# EAGLE design LOCO-Servo (EAGLE 9.7.0)

## Sheet 1 of 2
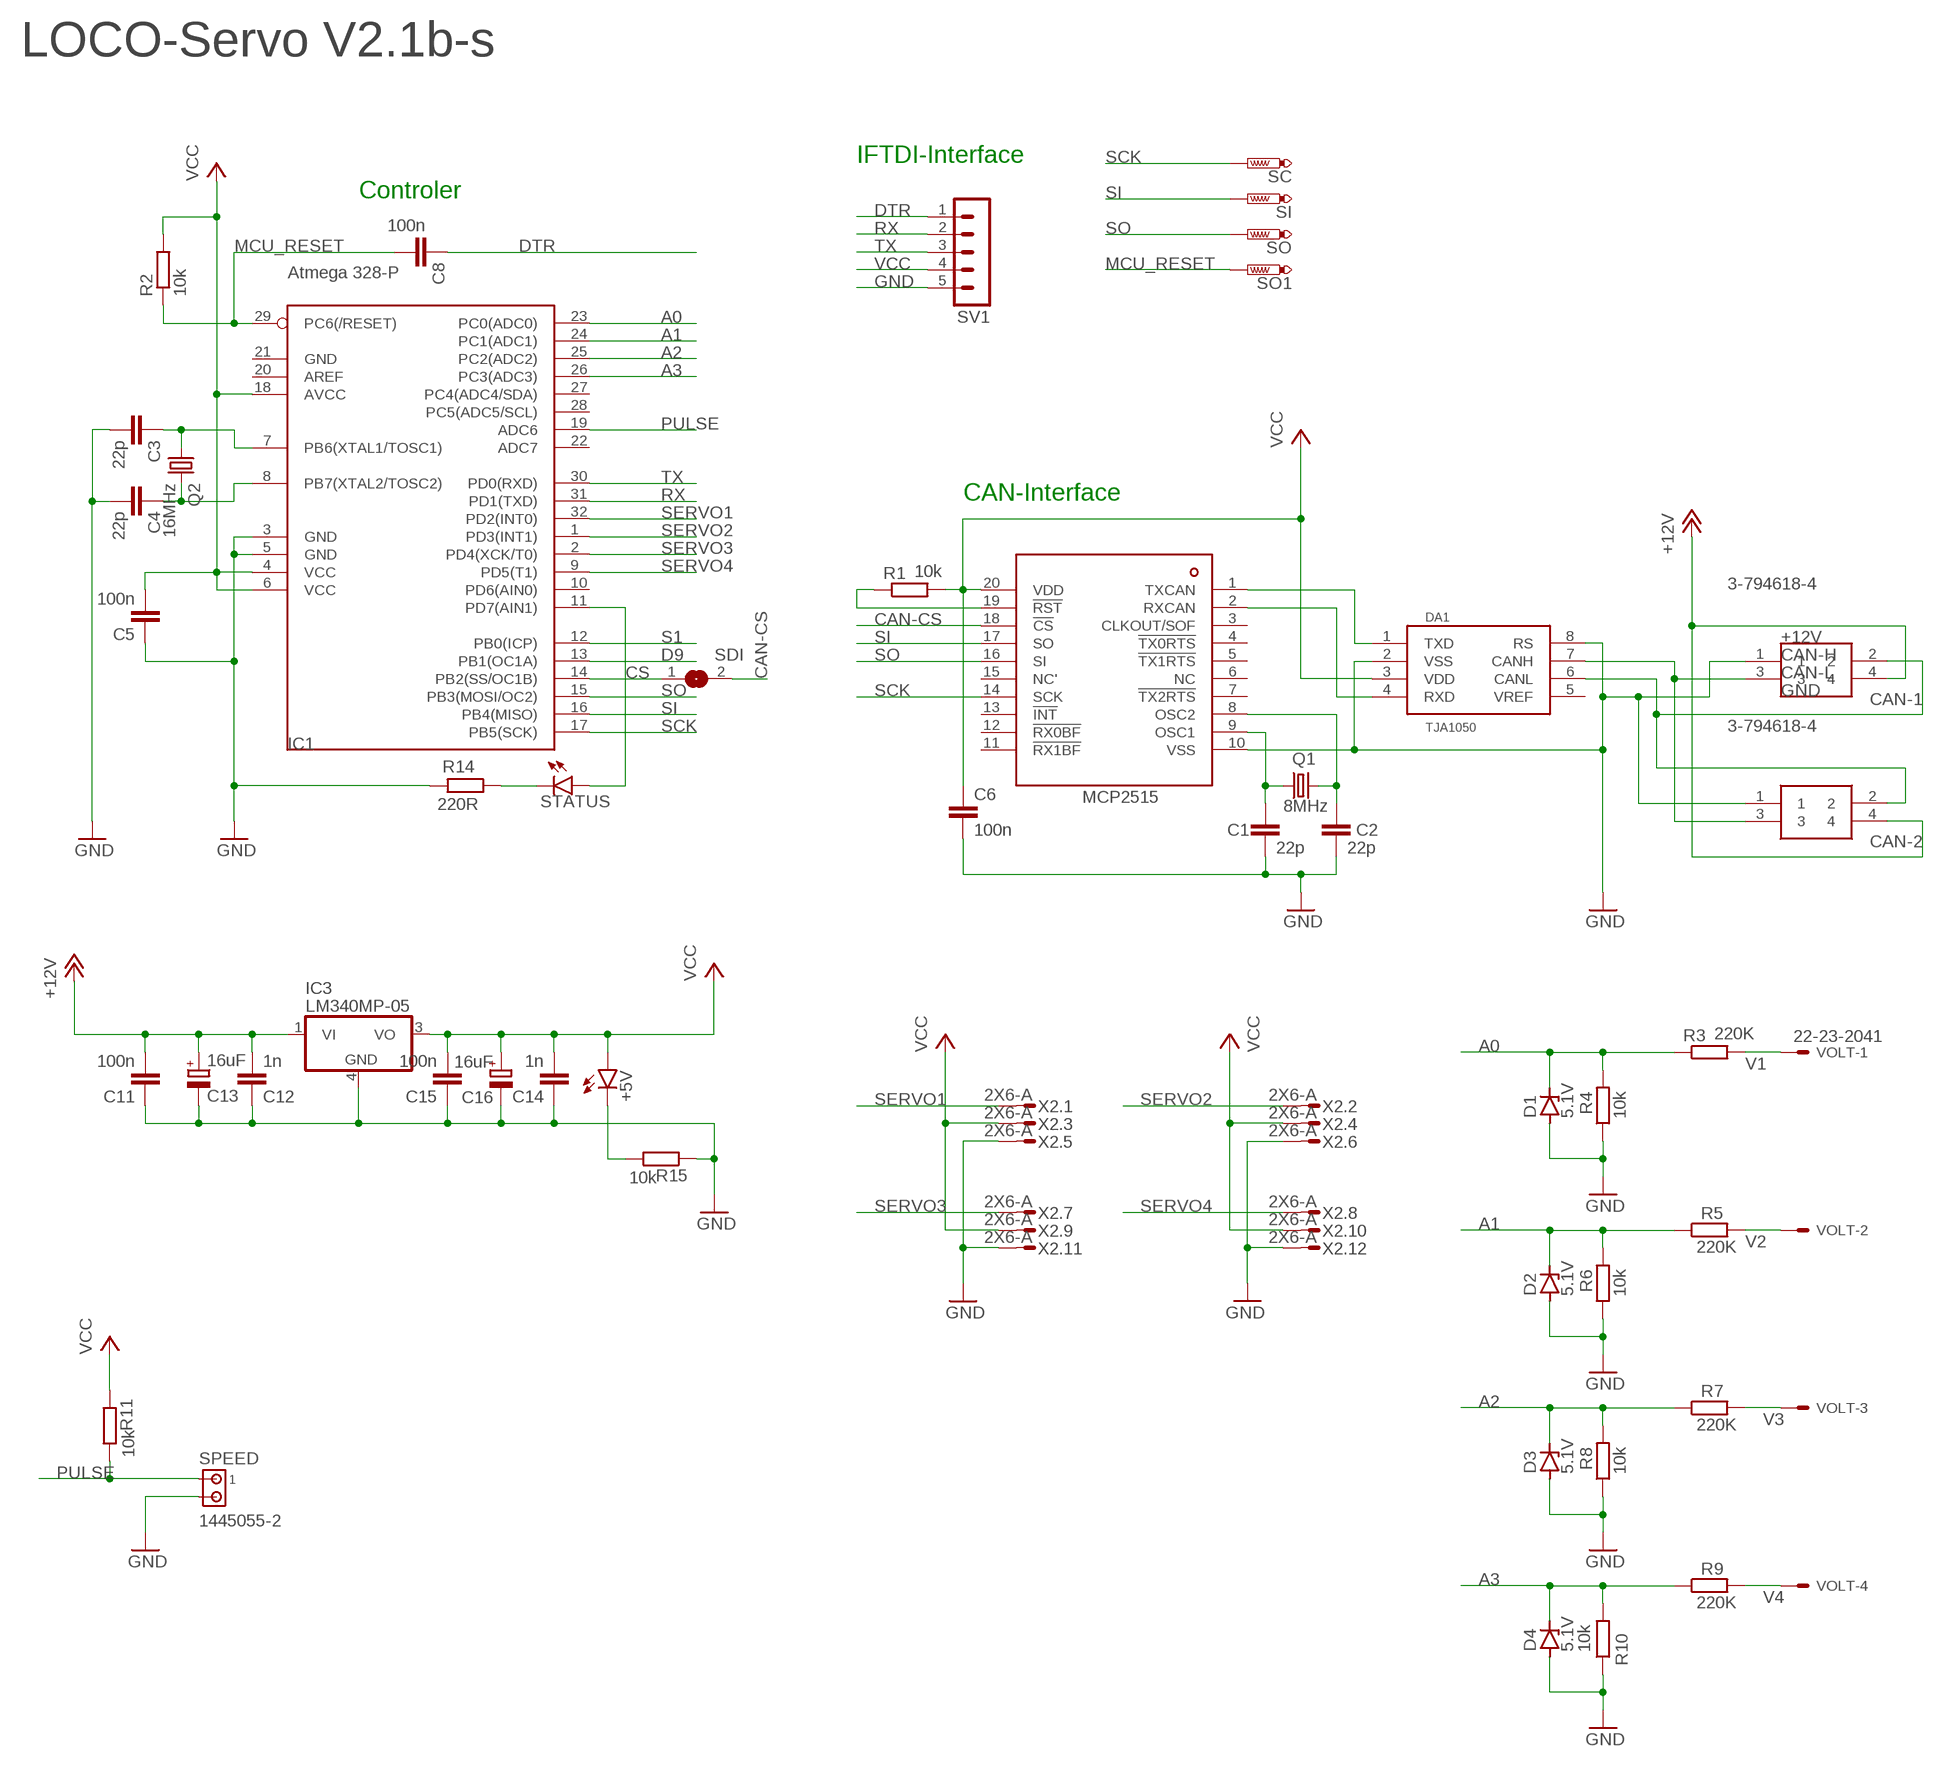
[diagram p0: schematic, sheet 1]

### Parts
+5V  LED_GREEN  LED_CHIP_GREEN-1608  [LEDC1608X39N_G]
C1  22p  C-EUC0402K  [C0402K]
C2  22p  C-EUC0402K  [C0402K]
C3  22p  C-EUC0402K  [C0402K]
C4  22p  C-EUC0402K  [C0402K]
C5  100n  C-EUC0402K  [C0402K]
C6  100n  C-EUC0402K  [C0402K]
C8  100n  C-EUC0402K  [C0402K]
C11  100n  C-EUC0402K  [C0402K]
C12  1n  C-EUC0402K  [C0402K]
C13  16uF  CPOL-EUA/3216-18W  [A/3216-18W]
C14  1n  C-EUC0402K  [C0402K]
C15  100n  C-EUC0402K  [C0402K]
C16  16uF  CPOL-EUA/3216-18W  [A/3216-18W]
CAN  STATUS  LED_CHIP_BLUE-1608  [LEDC1608X39N_B]
CAN-1  3-794618-4  [SHDRRA4W102P300_2X2_686X892X73]
CAN-2  3-794618-4  [SHDRRA4W102P300_2X2_686X892X73]
D1  5.1V  ZENER-DIODESOD80C  [SOD80C]
D2  5.1V  ZENER-DIODESOD80C  [SOD80C]
D3  5.1V  ZENER-DIODESOD80C  [SOD80C]
D4  5.1V  ZENER-DIODESOD80C  [SOD80C]
DA1  TJA1050  [SO08]
IC1  Atmega 328-P  MEGA8-AI  [TQFP32-08]
IC2  MCP2515  [TSSOP20]
IC3  LM340MP-05  [SOT223]
Q1  8MHz  CRYSTALHC49S  [HC49/S]
Q2  16MHz  CRYSTALHC49S  [HC49/S]
R1  10k  R-EU_MELF0102W  [MINI_MELF-0102W]
R2  10k  R-EU_MELF0102W  [MINI_MELF-0102W]
R3  220K  R-EU_MELF0102W  [MINI_MELF-0102W]
R4  10k  R-EU_MELF0102W  [MINI_MELF-0102W]
R5  220K  R-EU_MELF0102W  [MINI_MELF-0102W]
R6  10k  R-EU_MELF0102W  [MINI_MELF-0102W]
R7  220K  R-EU_MELF0102W  [MINI_MELF-0102W]
R8  10k  R-EU_MELF0102W  [MINI_MELF-0102W]
R9  220K  R-EU_MELF0102W  [MINI_MELF-0102W]
R10  10k  R-EU_MELF0102W  [MINI_MELF-0102W]
R11  10k  R-EU_MELF0102W  [MINI_MELF-0102W]
R14  220R  R-EU_MELF0102W  [MINI_MELF-0102W]
R15  10k  R-EU_MELF0102W  [MINI_MELF-0102W]
SC  PTR1B1,27  [B1,27]
SDI  SJ  [SJ]
SI  PTR1B1,27  [B1,27]
SO  PTR1B1,27  [B1,27]
SO1  PTR1B1,27  [B1,27]
SPEED  1445055-2  [1445055-2]
SV1  MA05-1  [MA05-1]
VOLT  22-23-2041  [22-23-2041]
X2  2X6-A  [4-794618-2]

### Nets
+12V: C11.2 C12.2 C13.+ CAN-1.4 CAN-2.4 IC3.1(VI)
A0: D1.C IC1.23(PC0(ADC0)) R3.1 R4.2
A1: D2.C IC1.24(PC1(ADC1)) R5.1 R6.2
A2: D3.C IC1.25(PC2(ADC2)) R7.1 R8.2
A3: D4.C IC1.26(PC3(ADC3)) R9.1 R10.2
CAN-CS: IC2.18(!CS) SDI.2
CAN-H: CAN-1.3 CAN-2.3 DA1.7(CANH)
CAN-L: CAN-1.2 CAN-2.2 DA1.6(CANL)
CAN-OCC1: C1.1 IC2.9(OSC1) Q1.1
CAN-OCC2: C2.1 IC2.8(OSC2) Q1.2
CS: IC1.14(PB2(SS/OC1B)) SDI.1
D9: IC1.13(PB1(OC1A))
DTR: C8.1 SV1.1
GND: C1.2 C2.2 C3.2 C4.2 C5.1 C6.2 C11.1 C12.1 C13.- C14.1 C15.1 C16.- CAN-1.1 CAN-2.1 D1.A D2.A D3.A D4.A DA1.2(VSS) DA1.8(RS) IC1.3(GND) IC1.5(GND) IC2.10(VSS) IC3.4(GND) R4.1 R6.1 R8.1 R10.1 R14.2 R15.1 SPEED.2 SV1.5 X2.5 X2.6 X2.11 X2.12
MCU_RESET: C8.2 IC1.29(PC6(/RESET)) R2.1 SO1.TP
N$1: CAN.1(C) R14.1
N$2: CAN.2(A) IC1.11(PD7(AIN1))
N$6: IC2.19(!RST) R1.1
N$10: C3.1 IC1.7(PB6(XTAL1/TOSC1)) Q2.1
N$11: C4.1 IC1.8(PB7(XTAL2/TOSC2)) Q2.2
N$12: +5V.1(C) R15.2
PULSE: IC1.19(ADC6) R11.2 SPEED.1
RX: IC1.31(PD1(TXD)) SV1.2
RXCAN: DA1.4(RXD) IC2.2(RXCAN)
S1: IC1.12(PB0(ICP))
SCK: IC1.17(PB5(SCK)) IC2.14(SCK) SC.TP
SERVO1: IC1.32(PD2(INT0)) X2.1
SERVO2: IC1.1(PD3(INT1)) X2.2
SERVO3: IC1.2(PD4(XCK/T0)) X2.7
SERVO4: IC1.9(PD5(T1)) X2.8
SI: IC1.16(PB4(MISO)) IC2.17(SO) SI.TP
SO: IC1.15(PB3(MOSI/OC2)) IC2.16(SI) SO.TP
TX: IC1.30(PD0(RXD)) SV1.3
TXCAN: DA1.1(TXD) IC2.1(TXCAN)
V1: R3.2 VOLT.1
V2: R5.2 VOLT.2
V3: R7.2 VOLT.3
V4: R9.2 VOLT.4
VCC: +5V.2(A) C5.2 C6.1 C14.2 C15.2 C16.+ DA1.3(VDD) IC1.4(VCC) IC1.6(VCC) IC1.18(AVCC) IC2.20(VDD) IC3.3(VO) R1.2 R2.2 R11.1 SV1.4 X2.3 X2.4 X2.9 X2.10
Unconnected: DA1.5(VREF) IC1.10(PD6(AIN0)) IC1.20(AREF) IC1.22(ADC7) IC1.27(PC4(ADC4/SDA)) IC1.28(PC5(ADC5/SCL)) IC2.3(CLKOUT/SOF) IC2.4(!TX0RTS) IC2.5(!TX1RTS) IC2.6(NC) IC2.7(!TX2RTS) IC2.11(!RX1BF) IC2.12(!RX0BF) IC2.13(!INT) IC2.15(NC')

### Notes on the sheet
- LOCO-Servo V2.1b-s
- IFTDI-Interface
- Controler
- CAN-Interface

## Sheet 2 of 2

## Power pins joined to a net without a drawn wire
GND: IC1.21(GND)

## Library data of the parts
+5V = Opto-Electronic:LED_CHIP: LED - Generic; CATEGORY: Opto-Electronic; COLOR: Green; SUB-CATEGORY: LED
C1-C6 C8 C11 C12 C14 C15 = rcl:C-EU: CAPACITOR, European symbol; SPICEPREFIX: C
C13 C16 = rcl:CPOL-EU: POLARIZED CAPACITOR, European symbol; SPICEPREFIX: C
CAN = Opto-Electronic:LED_CHIP: LED - Generic; CATEGORY: Opto-Electronic; COLOR: Blue; SUB-CATEGORY: LED; VALUE: LED_BLUE
CAN-1 CAN-2 = SamacSys_Parts:3-794618-4: 4 way 2 row r/a header Mate-N-Lok Source: Datasheet <https://rs.componentsearchengine.com/Datasheets/2/3-794618-4.pdf>; DESCRIPTION: 4 way 2 row r/a header Mate-N-Lok; HEIGHT: 7.37mm; MANUFACTURER_NAME: TE Connectivity; MANUFACTURER_PART_NUMBER: 3-794618-4
D1-D4 = diode:ZENER-DIODE: Z-Diode
DA1 = TJA1050:TJA1050: High speed CAN transceiver Input levels compatible with 3.3 V and 5 V devices 5V supply
IC1 = atmel:MEGA8: MICROCONTROLLER 8 Kbytes FLASH, 1 kbytes SRAM, 512 bytes EEPROM, USART, 6-channel 10 bit ADC, 2-channel 8 bit ADC Pin compatible with Atmega48, ATMega88, ATMega168 Source: avr.lbr; MPN: ATMEGA8-16AU; OC_FARNELL: 9171371; OC_NEWARK: 73M8863
IC2 = mcp2514:MCP2515: Microchip Technology’s MCP2515 is a stand-alone Controller Area Network (CAN) controller that implements the CAN specification, version 2.0B. It is capable of transmitting and receiving both standard and extended data and remote frames. The MCP2515 has two acceptance masks and six acceptance filters that are used to filter out unwanted messages, thereby reducing the host MCUs overhead. The MCP2515 interfaces with microcontrollers (MCUs) via an industry standard Serial Peripheral Interface (SPI).
IC3 = linear:LM340?-*: Positive VOLTAGE REGULATOR Source: http://cache.national.com/ds/LM/LM340.pdf
Q1 Q2 = crystal:CRYSTAL: CRYSTAL; OC_FARNELL: 1667008; OC_NEWARK: unknown
R1-R11 R14 R15 = rcl:R-EU_: RESISTOR, European symbol; SPICEPREFIX: R
SC SI SO SO1 = testpad:PTR1: TEST PIN
SDI = jumper:SJ: SMD solder JUMPER
SPEED = con-amp:1445055-2: Micro MATE-N-LOK Connectors grid 1.5 mm Source: ENG_CD_1445055_A.pdf
SV1 = con-lstb:MA05-1: PIN HEADER; OC_FARNELL: unknown; OC_NEWARK: unknown
VOLT = con-molex:22-23-2041: .100" (2.54mm) Center Header - 4 Pin; MF: MOLEX; MPN: 22-23-2041; OC_FARNELL: 1462920; OC_NEWARK: 38C0355
X2 = con-amp-micro-mate-n-lock:2X6

## Board
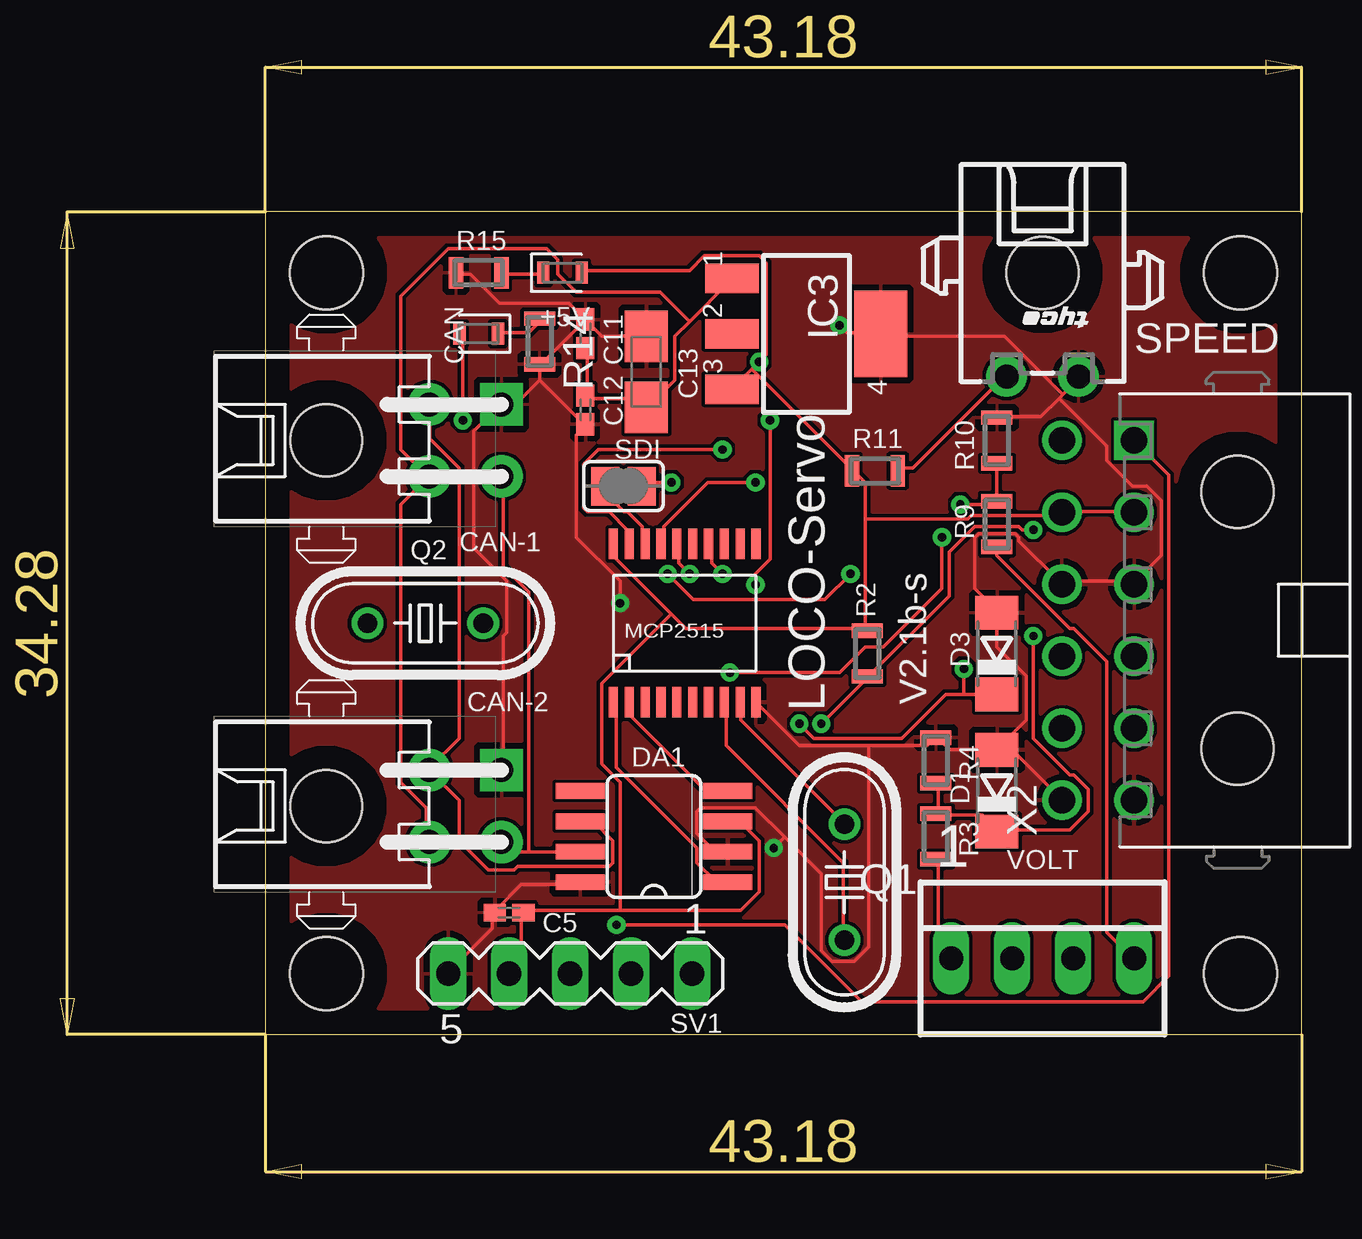
[diagram p1: board, top side]
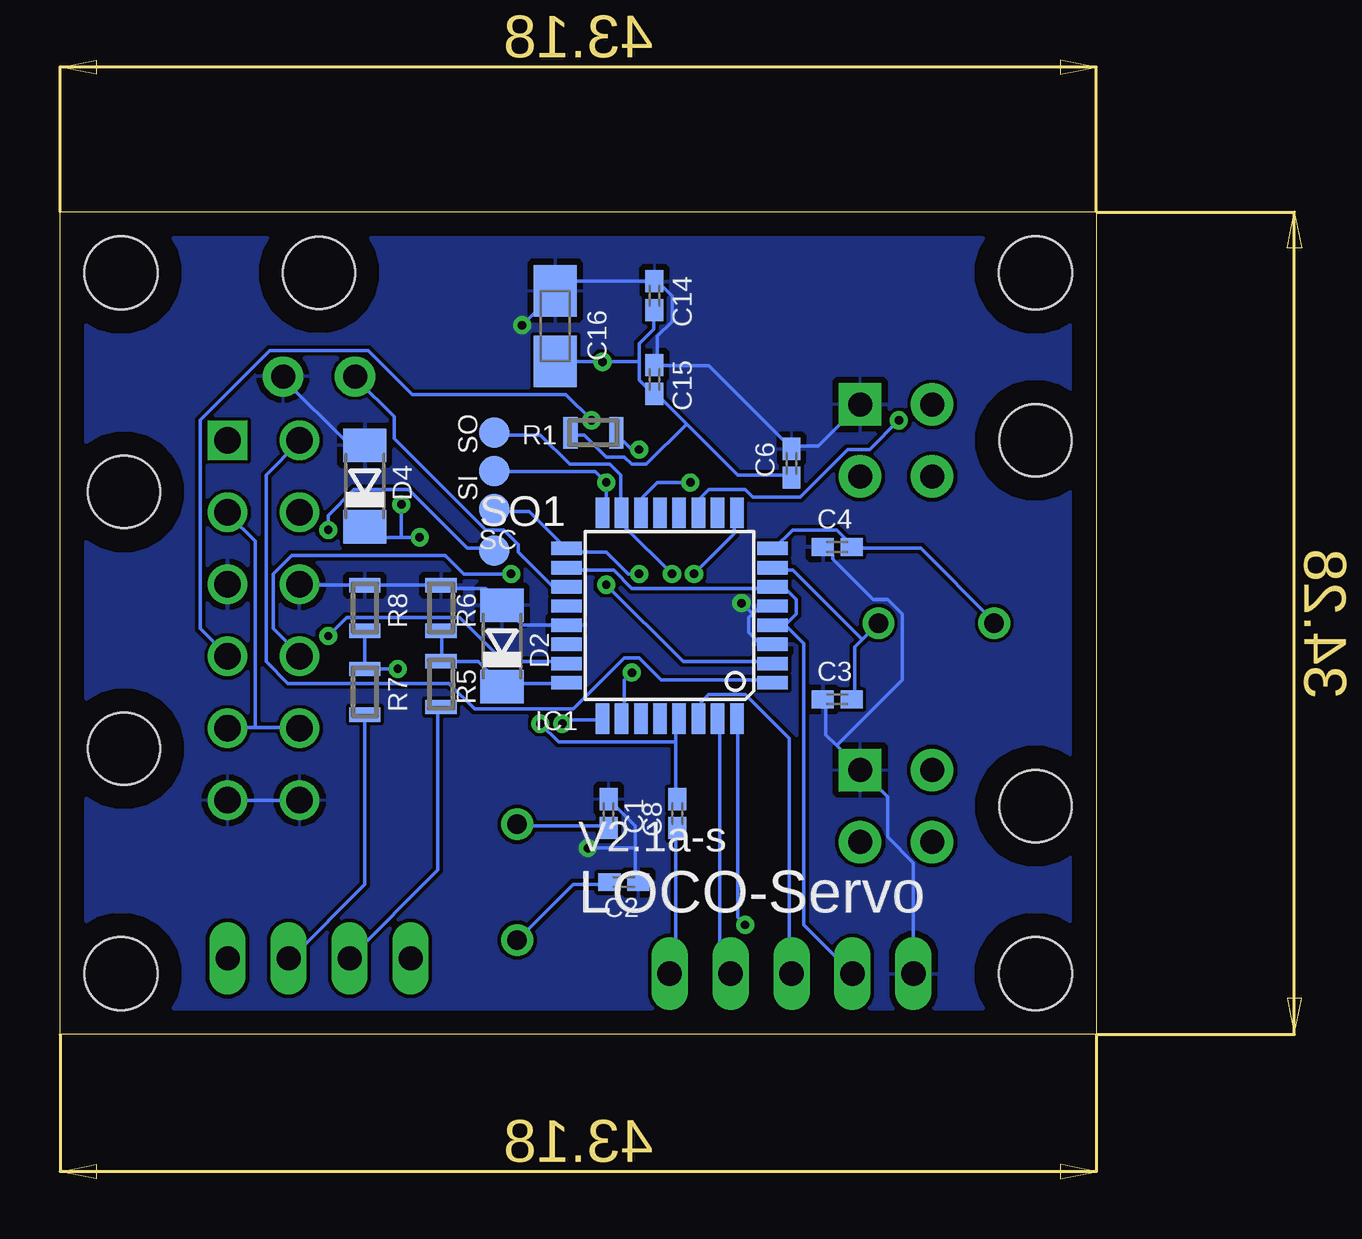
[diagram p2: board, bottom side, seen from below]

Size 43.18 x 34.29 mm. Coordinates in mm from the lower left corner, seen from the top.
Outline: 0,0 43.18,0 43.18,34.29 0,34.29 0,0
Copper layers (1*16): Top / Bottom
Stack-up Default Layer Stack: Top User Defined 0.035mm / Dielectric-1 User Defined 1.5mm / Bottom User Defined 0.035mm
Design rules "default": minimum track width 6mil, minimum drill 0.35mm, track to track 6mil, track to pad 6mil, pad to pad 6mil, via to via 6mil, smd to smd 6mil, copper to edge 40mil, drill to drill 6mil, minimum pad ring 10mil, minimum via ring 8mil, stop-mask expansion 4mil, vias tented up to drill 0mil, thermal gap 10mil
Holes 3.05 mm at 2.54,2.54 2.54,31.75 40.64,2.54 40.64,31.75

### Footprints (pad centres in the part's own frame; a part is rotated, then mirrored left to right if it is on the bottom)
LEDC1608X39N_G = smd 0.512 x 0.912: 1 -0.8,0; 2 0.8,0
C0402K = smd 0.925 x 0.74: 1 -0.6,0; 2 0.6,0
A/3216-18W = smd 2.15 x 1.8: + 1.475,0; - -1.475,0
LEDC1608X39N_B = smd 0.512 x 0.912: 1 -0.8,0; 2 0.8,0
SHDRRA4W102P300_2X2_686X892X73 = drill 1 pad 1.778 square: 1 1.5,-7.3 | drill 1 pad 1.778: 2 1.5,-4.3; 3 -1.5,-7.3; 4 -1.5,-4.3 | hole 3: 0,0
SOD80C = smd 1.4 x 1.8: A 1.7,0; C -1.7,0
SO08 = smd 0.66 x 2.032: 1 -1.905,-3.073; 2 -0.635,-3.073; 3 0.635,-3.073; 4 1.905,-3.073; 5 1.905,3.073; 6 0.635,3.073; 7 -0.635,3.073; 8 -1.905,3.073
TQFP32-08 = smd 1.27 x 0.559: 1 -4.293,2.8; 2 -4.293,2; 3 -4.293,1.2; 4 -4.293,0.4; 5 -4.293,-0.4; 6 -4.293,-1.2; 7 -4.293,-2; 8 -4.293,-2.8; 17 4.293,-2.8; 18 4.293,-2; 19 4.293,-1.2; 20 4.293,-0.4; 21 4.293,0.4; 22 4.293,1.2; 23 4.293,2; 24 4.293,2.8 | smd 0.559 x 1.27: 9 -2.8,-4.293; 10 -2,-4.293; 11 -1.2,-4.293; 12 -0.4,-4.293; 13 0.4,-4.293; 14 1.2,-4.293; 15 2,-4.293; 16 2.8,-4.293; 25 2.8,4.293; 26 2,4.293; 27 1.2,4.293; 28 0.4,4.293; 29 -0.4,4.293; 30 -1.2,4.293; 31 -2,4.293; 32 -2.8,4.293
TSSOP20 = smd 1.27 x 0.381: 1 -3.302,2.642; 2 -3.302,1.981; 3 -3.302,1.321; 4 -3.302,0.66; 5 -3.302,0; 6 -3.302,-0.66; 7 -3.302,-1.321; 8 -3.302,-1.981; 9 -3.302,-2.642; 10 -3.302,-3.302; 11 3.302,-3.302; 12 3.302,-2.642; 13 3.302,-1.981; 14 3.302,-1.321; 15 3.302,-0.66; 16 3.302,0; 17 3.302,0.66; 18 3.302,1.321; 19 3.302,1.981; 20 3.302,2.642
SOT223 = smd 1.219 x 2.235: 1 -2.311,-3.099; 2 0,-3.099; 3 2.311,-3.099 | smd 3.6 x 2.2: 4 0,3.099
HC49/S = drill 0.813: 1 -2.413,0; 2 2.413,0
MINI_MELF-0102W = smd 0.6 x 1.3: 1 -0.95,0; 2 0.95,0
B1,27 = smd 1.27 x 1.27: TP 0,0
SJ = smd 1.168 x 1.6: 1 -0.762,0; 2 0.762,0
1445055-2 = drill 1 pad 1.676: 1 1.5,4.32; 2 -1.5,4.32 | hole 3: 0,0
MA05-1 = drill 1.016 long: 1 -5.08,0; 2 -2.54,0; 3 0,0; 4 2.54,0; 5 5.08,0
22-23-2041 = drill 1 long: 1 -3.81,0; 2 -1.27,0; 3 1.27,0; 4 3.81,0
4-794618-2 = drill 1.1 square: 1 0,0 | drill 1.1: 2 0,3; 3 -3,0; 4 -3,3; 5 -6,0; 6 -6,3; 7 -9,0; 8 -9,3; 9 -12,0; 10 -12,3; 11 -15,0; 12 -15,3 | hole 3: -2.15,-4.32; -12.85,-4.32

### Placement (x,y rotation side)
+5V  12.38,31.75 0 top
C1  20.32,9.21 90 bottom
C2  19.68,6.35 0 bottom
C3  10.79,13.97 180 bottom
C4  10.79,20.32 180 bottom
C5  10.16,5.08 0 top
C6  12.7,23.81 90 bottom
C8  17.46,9.21 90 bottom
C11  13.34,29.21 270 top
C12  13.34,26.04 90 top
C13  15.88,27.62 270 top
C14  18.41,30.8 270 bottom
C15  18.41,27.3 270 bottom
C16  22.54,29.53 270 bottom
CAN  8.89,29.21 180 top
CAN-1  2.54,24.77 90 top
CAN-2  2.54,9.53 90 top
D1  30.48,10.16 90 top
D2  24.77,16.19 90 bottom
D3  30.48,15.88 90 top
D4  30.48,22.86 90 bottom
DA1  16.19,8.26 90 top
IC1  17.78,17.46 180 bottom
IC2  17.14,17.14 90 top
IC3  22.54,29.21 270 top
Q1  24.13,6.35 270 top
Q2  6.67,17.14 180 top
R1  20.95,25.08 180 bottom
R2  25.08,15.88 90 top
R3  27.94,8.26 270 top
R4  27.94,11.43 270 top
R5  27.3,14.61 270 bottom
R6  27.3,17.78 270 bottom
R7  30.48,14.29 270 bottom
R8  30.48,17.78 270 bottom
R9  30.48,21.27 270 top
R10  30.48,24.77 270 top
R11  25.4,23.5 0 top
R14  11.43,28.89 270 top
R15  8.89,31.75 0 top
SC  25.08,21.91 0 bottom
SDI  14.92,22.86 180 top
SI  25.08,23.5 0 bottom
SO  25.08,25.08 0 bottom
SO1  25.08,20.17 0 bottom
SPEED  32.38,31.75 180 top
SV1  12.7,2.54 180 top
VOLT  32.38,3.17 0 top
X2  36.2,24.77 90 top

### Tracks (layer width: path | path; a pad name or v marks a point on that pad's centre or on a via)
+12V
  Top 0.152: C11.2 13.41,28.5 13.41,26.67 C12.2 13.41,26.52 15.54,26.52 15.85,26.21 C13.+ 16,26.21 17.07,27.28 17.07,29.11 17.68,29.72 | 17.68,29.72 19.36,31.39 IC3.1 | CAN-2.4 6.71,8.08 6.71,9.45 5.64,10.52 5.64,22.1 6.71,23.16 CAN-1.4 6.71,23.32 5.64,24.38 5.64,30.79 7.62,32.77 11.73,32.77 12.19,32.31 12.19,31.7 12.95,30.94 16.46,30.94 17.68,29.72
A0  (via drill 0.35)
  Top 0.152: R4.2 28.04,10.36 28.04,9.3 R3.1 28.04,9.14 29.87,9.14 30.48,8.53 | v32,16.61 32,12.34 33.53,10.82 33.68,10.82 34.29,10.21 34.29,9.3 33.53,8.53 30.48,8.53 | 30.48,8.53 D1.C
  Bottom 0.152: v32,16.61 31.24,17.37 26.52,17.37 24.69,15.54 22.1,15.54 IC1.23
A1
  Bottom 0.152: R6.2 27.28,16.76 27.28,15.7 R5.1 27.28,15.54 25.76,15.54 24.84,14.63 D2.C 24.69,14.63 22.1,14.63 IC1.24
A2  (via drill 0.35)
  Top 0.152: v22.25,12.95 22.86,12.34 26.52,12.34 28.35,14.17 29.11,14.17 | 29.11,14.17 D3.C | 29.11,14.17 v29.11,15.24
  Bottom 0.152: R8.2 R7.1 | v22.25,12.95 22.1,13.11 20.73,13.11 IC1.25 | v29.11,15.24 R7.1 | R7.1
A3  (via drill 0.35)
  Top 0.152: R10.2 R9.1 30.48,22.1 v28.96,22.1 | v19.36,15.09 23.93,15.09 24.99,16.15 25.76,16.15 28.19,18.59 v28.19,20.73
  Bottom 0.152: v19.36,15.09 19.66,14.78 19.66,13.26 IC1.26 | 28.96,20.73 30.18,20.73 30.48,21.03 D4.C | 28.96,20.73 v28.19,20.73 | 28.96,20.73 v28.96,22.1
CAN-CS
  Top 0.152: IC2.18 15.7,20.57 15.7,21.18 15.09,21.79 14.94,21.79 14.17,22.55 14.17,22.86 SDI.2
CAN-H
  Top 0.152: 10.97,7.62 10.21,7.62 9.91,7.92 CAN-2.3 | 10.97,7.62 DA1.7 | 10.97,7.62 10.97,18.44 9.91,19.51 9.91,23.16 CAN-1.3
CAN-L
  Top 0.152: DA1.6 13.26,8.84 13.72,8.84 14.48,8.08 14.48,7.16 14.33,7.01 10.52,7.01 10.36,6.86 9.3,6.86 8.08,8.08 8.08,9.75 6.86,10.97 CAN-2.2 6.86,11.12 8.08,12.34 8.08,23.62 6.86,24.84 6.86,26.21 CAN-1.2
CAN-OCC1
  Top 0.152: IC2.9 19.81,13.72 19.81,13.11 24.08,8.84 Q1.1
  Bottom 0.152: C1.1 20.42,8.69 24.08,8.69 Q1.1
CAN-OCC2
  Top 0.152: IC2.8 19.2,13.72 19.2,12.04 24.08,7.16 24.08,3.96 Q1.2
  Bottom 0.152: C2.1 20.42,6.25 21.79,6.25 24.08,3.96 Q1.2
CS  (via drill 0.35)
  Top 0.152: v16.92,23.01 15.85,23.01 15.7,22.86 SDI.1
  Bottom 0.152: v16.92,23.01 18.29,23.01 18.9,22.4 18.9,21.79 IC1.14
DTR
  Bottom 0.152: C8.1 17.53,8.53 17.53,2.74 17.68,2.59 SV1.1
GND  (via drill 0.35)
  Top 0.152: 33.22,26.67 33.83,27.28 SPEED.2 | 33.22,26.67 33.07,26.52 | 33.07,26.52 32.31,25.76 30.48,25.76 R10.1 | 33.22,26.67 30.79,29.11 25.76,29.11 IC3.4 25.6,29.26 24.23,29.26 v23.93,29.57 | 33.07,26.52 35.05,24.54 35.05,23.93 36.12,22.86 36.73,22.86 37.34,22.25 37.34,19.96 36.27,18.9 X2.5 36.12,18.9 33.22,18.9 X2.6 33.07,18.9 31.39,20.57 31.39,20.73 31.24,20.88 29.72,20.88 29.57,20.73 29.57,18.59 30.48,17.68 D3.A 30.48,16.15 31.7,14.94 31.7,13.11 30.79,12.19 | IC2.10 22.25,12.04 25.15,12.04 | 25.15,12.04 27.58,12.04 27.89,12.34 R4.1 28.04,12.34 28.5,11.89 30.48,11.89 | 30.48,11.89 30.79,12.19 | 30.48,11.89 D1.A 30.79,12.19 | DA1.2 18.75,7.62 17.98,8.38 17.98,9.3 18.14,9.45 20.42,9.45 21.64,8.23 | 21.64,8.23 23.16,6.71 23.16,3.5 23.62,3.05 24.54,3.05 25.15,3.66 25.15,12.04 | 21.64,8.23 v21.18,7.77 | 30.79,12.19 33.07,9.91 X2.12 | SV1.5 7.62,2.59 9.45,4.42 9.45,5.03 C5.1 9.6,5.18 10.67,6.25 13.11,6.25 DA1.8 | 11.43,27.28 13.26,25.45 C12.1 13.26,25.3 12.95,24.99 12.95,20.73 14.78,18.9 v14.78,17.98 | 11.43,27.89 11.43,27.28 | 11.43,27.89 13.26,29.72 C11.1 | 11.43,27.89 R14.2 | R15.1 8.08,31.7 8.53,31.7 9.75,30.48 12.65,30.48 13.26,29.87 C11.1 | C13.- 15.85,29.11 14.02,29.11 13.41,29.72 C11.1 | 11.43,27.28 10.52,26.36 9.91,26.36 CAN-1.1 9.75,26.21 8.69,25.15 8.69,20.27 10.06,18.9 10.06,16.76 9.91,16.61 9.91,11.12 CAN-2.1
  Bottom 0.152: D4.A 30.48,24.69 31.24,24.69 33.83,27.28 SPEED.2 | IC1.21 22.1,17.07 23.93,17.07 24.69,17.83 D2.A 24.84,17.98 25.45,18.59 27.28,18.59 R6.1 27.43,18.75 30.48,18.75 | 30.48,18.75 33.07,18.75 X2.6 | 30.48,18.75 R8.1 | X2.12 33.22,9.75 36.12,9.75 X2.11 | 19.2,7.77 19.2,8.69 20.27,9.75 C1.2 | 19.2,7.77 19.2,6.4 C2.2 | v21.18,7.77 19.2,7.77 | 10.82,12.04 9.91,11.12 CAN-2.1 9.75,10.97 8.69,9.91 8.69,8.23 7.62,7.16 SV1.5 | 10.82,12.04 11.28,12.5 11.28,13.87 C3.2 | 10.82,12.04 8.08,14.78 8.08,17.53 8.69,18.14 9.3,18.14 10.97,19.81 10.97,19.96 11.28,20.27 C4.2 | CAN-1.1 9.91,26.21 11.58,24.54 12.65,24.54 C6.2 12.8,24.54 16.15,27.89 18.29,27.89 C15.1 18.29,28.04 18.29,29.11 17.68,29.72 17.68,30.79 18.29,31.39 C14.1 18.44,31.39 22.1,31.39 22.4,31.09 C16.- 22.55,30.94 v23.93,29.57 | 14.33,17.53 14.02,17.83 13.56,17.83 IC1.5 | 14.33,17.53 14.48,17.37 14.48,16.76 14.02,16.31 13.56,16.31 IC1.3 | v14.78,17.98 14.33,17.53
  pour Bottom: 0,34.29 43.18,34.29 43.18,0 0,0
  pour Top: 0,34.29 43.18,34.29 43.18,0 0,0
MCU_RESET  (via drill 0.35)
  Top 0.152: v32,21.03 31.55,21.03 31.39,21.18 29.57,21.18 28.5,20.12 28.5,18.29 25.15,14.94 R2.1 24.99,14.78 v23.16,12.95
  Bottom 0.152: 17.53,12.19 17.53,13.11 IC1.29 | 17.53,12.19 17.53,9.91 C8.2 | v32,21.03 32,21.64 30.94,22.71 28.65,22.71 26.21,20.27 25.15,20.27 SO1.TP | 17.53,12.19 22.4,12.19 v23.16,12.95
N$1
  Top 0.152: CAN.1 9.75,29.26 10.97,29.26 11.43,29.72 R14.1
N$2  (via drill 0.35)
  Top 0.152: v8.23,25.6 8.23,29.11 CAN.2
  Bottom 0.152: v8.23,25.6 9.45,24.38 10.36,24.38 12.34,22.4 14.33,22.4 14.63,22.71 16.15,22.71 16.46,22.4 16.46,21.79 IC1.11
N$6  (via drill 0.35)
  Top 0.152: v19.05,24.38 13.87,24.38 13.26,23.77 13.26,21.95 13.41,21.79 14.33,21.79 15.09,21.03 15.09,20.57 IC2.19
  Bottom 0.152: v19.05,24.38 19.36,24.38 19.96,24.99 R1.1
N$10
  Bottom 0.152: 9.75,16.46 9.14,17.07 Q2.1 | 9.75,16.46 10.06,16.15 10.06,14.02 C3.1 | 9.75,16.46 12.65,19.36 13.41,19.36 IC1.7
N$11
  Bottom 0.152: IC1.8 13.41,20.27 12.65,21.03 10.82,21.03 10.21,20.42 C4.1 10.06,20.27 7.32,20.27 4.27,17.22 Q2.2
N$12
  Top 0.152: +5V.1 11.58,31.7 9.91,31.7 R15.2
PULSE
  Top 0.152: R11.2 26.36,23.62 26.98,23.62 30.79,27.43 SPEED.1
  Bottom 0.152: IC1.19 22.1,18.75 22.71,18.75 24.08,20.12 24.08,20.42 24.69,21.03 25.45,21.03 29.26,24.84 29.26,25.76 30.79,27.28 SPEED.1
RX
  Bottom 0.152: IC1.31 15.7,13.11 15.7,3.05 15.24,2.59 SV1.2
RXCAN
  Top 0.152: IC2.2 15.24,13.72 15.24,13.26 18.29,10.21 19.2,10.21 DA1.4
SCK  (via drill 0.35)
  Top 0.152: v19.05,19.2 18.59,19.66 18.59,20.42 IC2.14
  Bottom 0.152: v19.05,19.2 19.51,19.2 20.42,20.12 21.95,20.12 IC1.17 22.1,20.27 23.62,21.79 24.99,21.79 SC.TP
SERVO1  (via drill 0.35)
  Top 0.152: v14.63,4.57 21.64,4.57 24.84,1.37 36.58,1.37 37.64,2.44 37.64,23.32 X2.1
  Bottom 0.152: v14.63,4.57 14.94,4.88 14.94,13.11 IC1.32
SERVO2
  Bottom 0.152: IC1.1 13.56,14.78 18.14,14.78 19.05,15.7 19.66,15.7 21.79,13.56 25.91,13.56 26.98,14.63 33.68,14.63 34.59,15.54 34.59,23.32 33.22,24.69 X2.2
SERVO3  (via drill 0.35)
  Top 0.152: v20.42,18.75 20.42,19.2 21.03,19.81 v21.03,25.6
  Bottom 0.152: v20.42,18.75 17.22,15.54 13.56,15.54 IC1.2 | v21.03,25.6 22.1,26.67 28.5,26.67 30.33,28.5 34.44,28.5 37.34,25.6 37.34,16.92 36.27,15.85 X2.7
SERVO4  (via drill 0.35)
  Top 0.152: v16.76,19.2 17.83,18.14 23.32,18.14 v24.38,19.2
  Bottom 0.152: v16.76,19.2 15.09,20.88 15.09,21.64 IC1.9 | v24.38,19.2 26.36,19.2 27.13,19.96 33.53,19.96 34.29,19.2 34.29,16.92 33.22,15.85 X2.8
SI  (via drill 0.35)
  Top 0.152: v20.42,23.01 18.44,23.01 16.61,21.18 16.61,20.57 IC2.17
  Bottom 0.152: IC1.16 20.57,21.79 20.42,21.95 v20.42,23.01 20.88,23.47 24.99,23.47 SI.TP
SO  (via drill 0.35)
  Top 0.152: v17.68,19.2 17.22,19.66 17.22,20.42 IC2.16
  Bottom 0.152: v17.68,19.2 19.66,21.18 19.66,21.64 IC1.15 19.81,21.79 19.81,23.32 20.27,23.77 21.95,23.77 23.16,24.99 24.99,24.99 SO.TP
TX
  Bottom 0.152: IC1.30 16.46,13.26 16.46,13.87 16.15,14.17 14.63,14.17 12.8,12.34 12.8,2.59 SV1.3
TXCAN
  Top 0.152: IC2.1 14.63,13.72 14.63,11.12 17.98,7.77 17.98,7.16 18.75,6.4 19.2,6.4 DA1.1
V1
  Top 0.152: R3.2 28.04,7.16 28.04,3.66 28.5,3.2 VOLT.1
V2
  Bottom 0.152: VOLT.2 27.43,6.86 27.43,13.56 R5.2
V3
  Bottom 0.152: R7.2 30.48,6.25 33.53,3.2 VOLT.3
V4
  Top 0.152: R9.2 30.48,19.96 33.53,16.92 33.68,16.92 35.05,15.54 35.05,4.27 36.12,3.2 VOLT.4
VCC  (via drill 0.35)
  Top 0.152: SV1.4 10.67,3.05 10.67,5.03 C5.2 10.82,5.18 14.78,5.18 | 14.78,5.18 19.81,5.18 20.57,5.94 20.57,8.08 19.81,8.84 19.36,8.84 DA1.3 | X2.3 36.12,21.79 33.22,21.79 X2.4 33.07,21.64 29.41,21.64 29.26,21.49 24.99,21.49 | 16.92,17.53 17.53,16.92 24.99,16.92 | 16.92,17.53 14.63,19.81 14.63,20.42 IC2.20 | 20.27,27.74 19.51,26.98 IC3.3 | 20.27,27.74 v20.57,28.04 20.88,28.35 20.88,32.16 20.57,32.46 18.29,32.46 17.68,31.85 13.26,31.85 +5V.2 | 20.27,27.74 24.38,23.62 R11.1 24.54,23.47 24.99,23.01 24.99,21.49 | 24.99,21.49 24.99,16.92 | 24.99,16.92 R2.2 | 14.78,5.18 14.78,10.52 14.02,11.28 14.02,14.63 16.92,17.53
  Bottom 0.152: 12.95,17.07 13.41,17.07 IC1.4 12.95,17.07 | 12.95,17.07 12.5,17.53 12.5,18.14 12.95,18.59 13.41,18.59 IC1.6 13.56,18.59 19.36,18.59 20.12,19.36 21.95,19.36 IC1.18 | 12.95,17.07 12.19,16.31 12.19,4.57 SV1.4 | 35.05,12.8 36.12,12.8 X2.9 | 35.05,12.8 33.22,12.8 X2.10 | 35.05,12.8 35.05,20.57 36.12,21.64 X2.3 | 17.07,25.45 18.29,26.67 C15.2 18.44,26.67 19.05,27.28 19.05,28.04 | 17.07,25.45 14.94,23.32 12.8,23.32 C6.1 | 19.05,28.04 19.05,28.8 18.44,29.41 18.44,30.18 C14.2 | 17.07,25.45 18.75,23.77 19.36,23.77 19.66,24.08 20.42,24.08 21.34,24.99 21.79,24.99 R1.2 | 19.05,28.04 v20.57,28.04 22.4,28.04 C16.+

### Text on the board
tNames: LOCO-Servo | V2.1b-s | 1
bNames: V2.1a-s | LOCO-Servo